# Altium schematic sheet down_converter_IF1.SchDoc: DOWN IF1
size A3; DocumentNumber: 18; Revision: 0; SheetNumber: 18; SheetTotal: 19
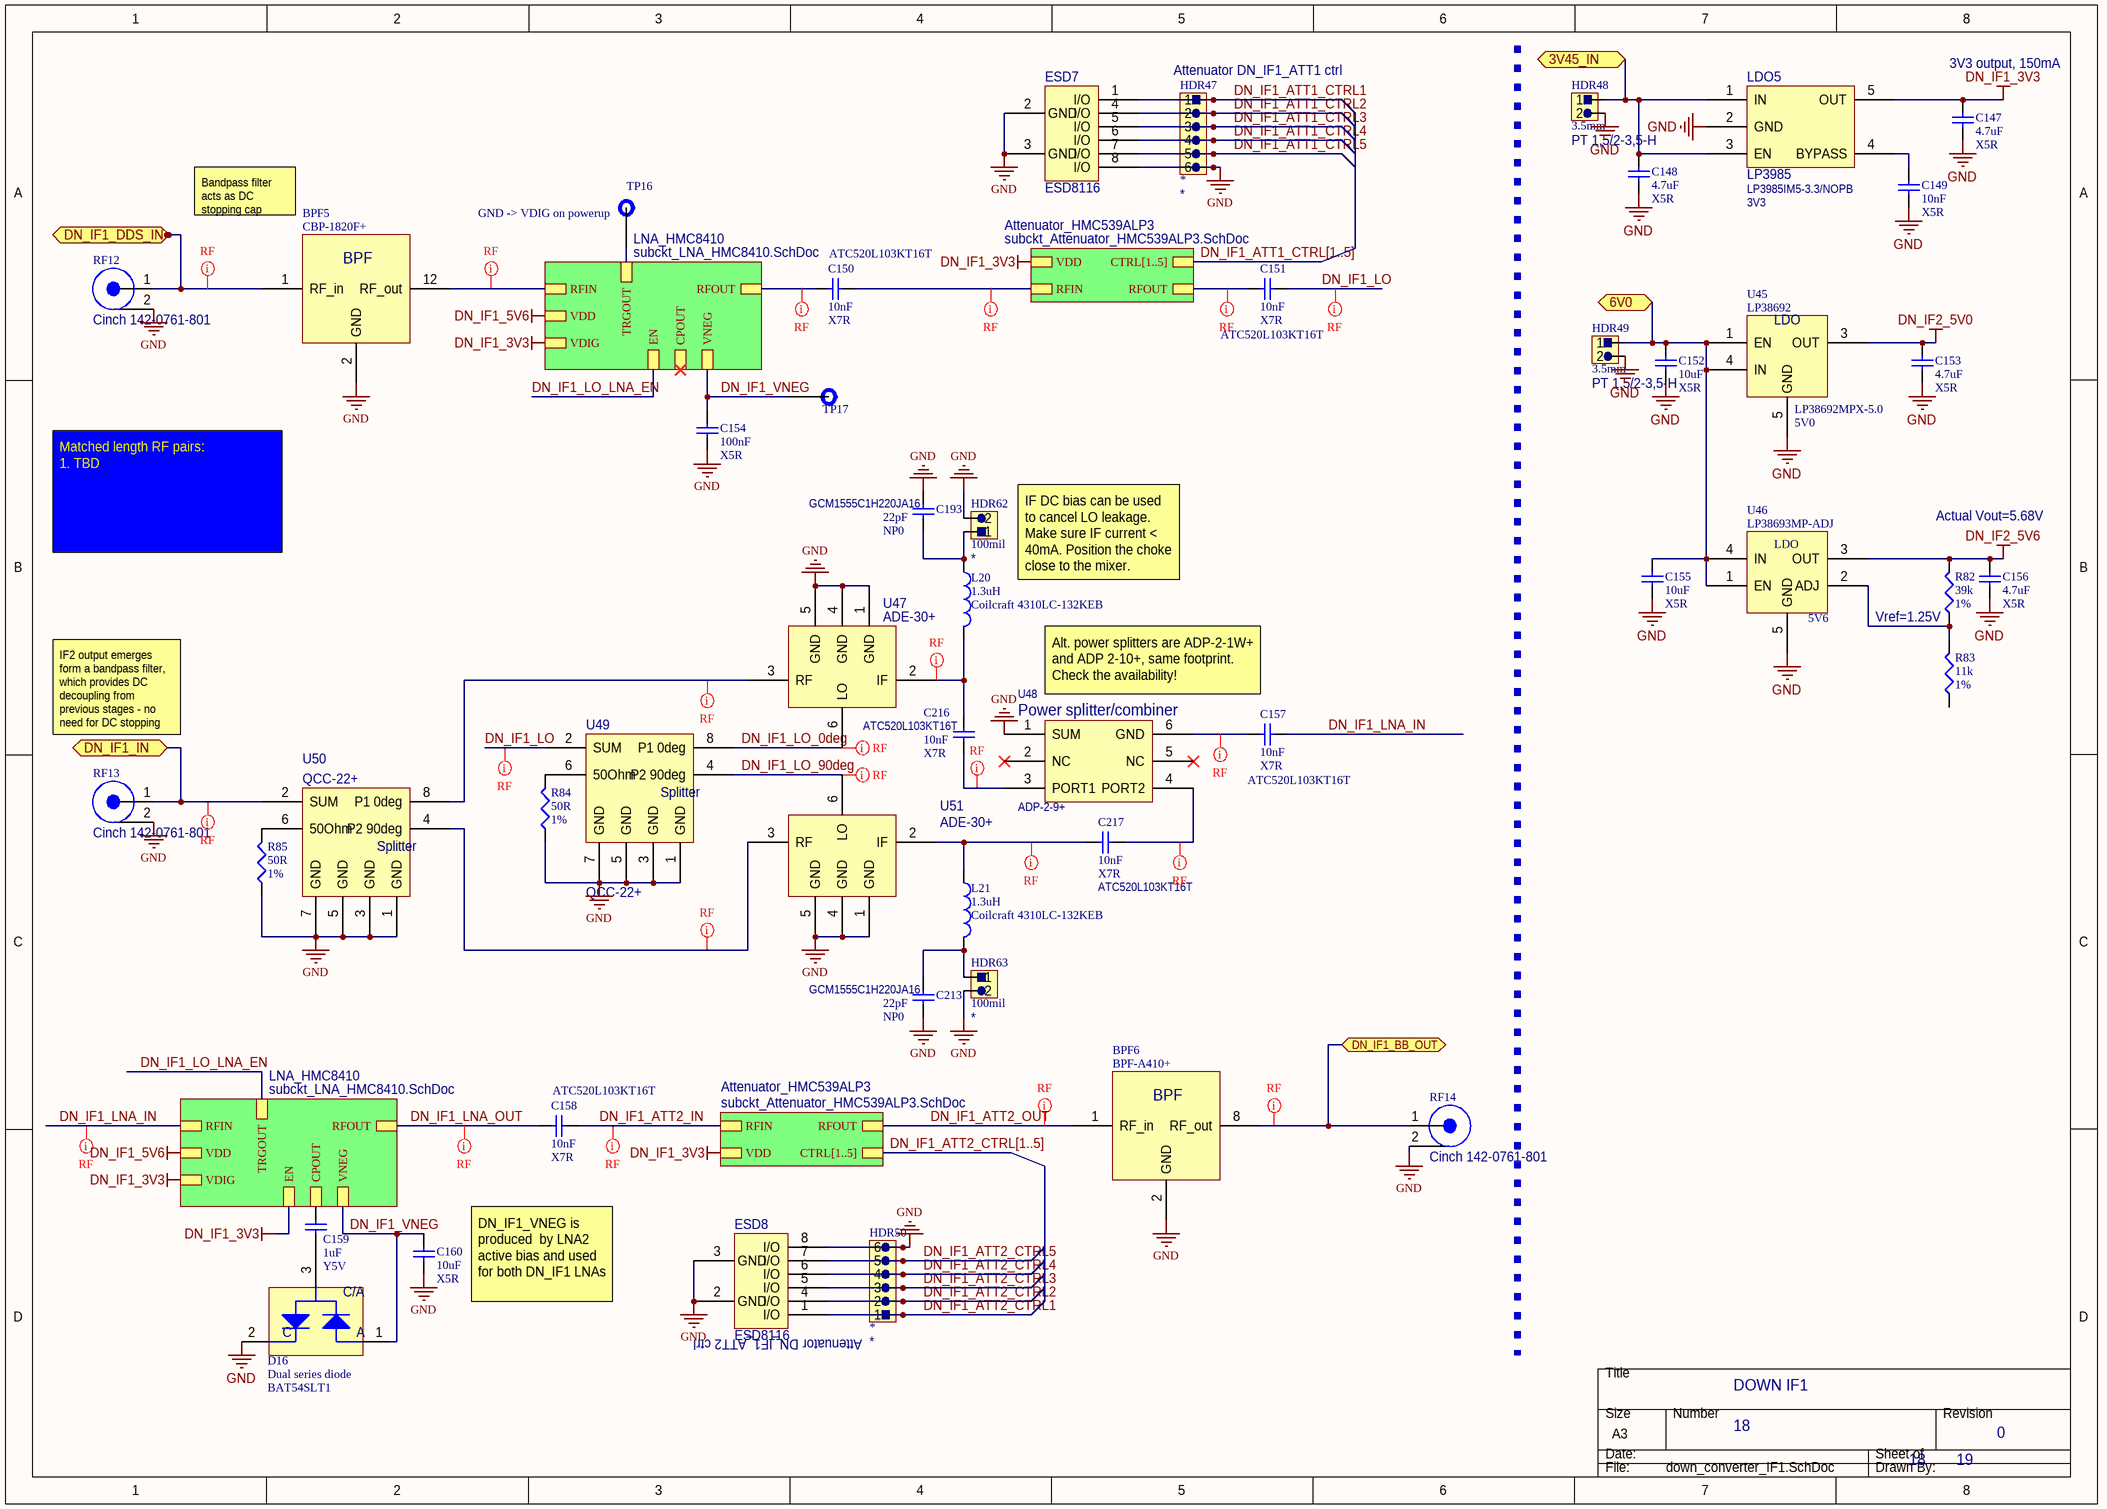
[diagram p0: down_converter_IF1.SchDoc]

## Parts
BPF5  CBP-1820F+
BPF6  BPF-A410+
C147  value 4.7uF  Dielectric: X5R  [CAP0603]  (hidden comment: Capacitor)
C148  value 4.7uF  Dielectric: X5R  [CAP0603]  (hidden comment: Capacitor)
C149  value 10nF  Dielectric: X5R  [CAP0603]  (hidden comment: Capacitor)
C150  ATC520L103KT16T  value 10nF  Dielectric: X7R  [TBD]
C151  ATC520L103KT16T  value 10nF  Dielectric: X7R  [TBD]
C152  value 10uF  Dielectric: X5R  [CAP0603]  (hidden comment: Capacitor)
C153  value 4.7uF  Dielectric: X5R  [TBD]  (hidden comment: Capacitor)
C154  value 100nF  Dielectric: X5R  [CAP0603]  (hidden comment: Capacitor)
C155  value 10uF  Dielectric: X5R  [CAP0603]  (hidden comment: Capacitor)
C156  value 4.7uF  Dielectric: X5R  [CAP0603]  (hidden comment: Capacitor)
C157  ATC520L103KT16T  value 10nF  Dielectric: X7R  [TBD]
C158  ATC520L103KT16T  value 10nF  Dielectric: X7R  [TBD]
C159  value 1uF  Dielectric: Y5V  [CAP0603]  (hidden comment: Capacitor)
C160  value 10uF  Dielectric: X5R  [CAP0603]  (hidden comment: Capacitor)
C193  value 22pF  Dielectric: NP0  Model: GCM1555C1H220JA16  [CAP0402]  (hidden comment: Capacitor)
C213  value 22pF  Dielectric: NP0  Model: GCM1555C1H220JA16  [CAP0402]  (hidden comment: Capacitor)
C216  value 10nF  Dielectric: X7R  [TBD]  (hidden comment: ATC520L103KT16T)
C217  value 10nF  Dielectric: X7R  [TBD]  (hidden comment: ATC520L103KT16T)
D16  Dual series diode  Model: BAT54SLT1  [SOT23-3]
ESD7  ESD8116
ESD8  ESD8116
HDR47  Header 6 pins  [TBD]  (value not drawn)
HDR48  Pitch: 3.5mm  Model: PT 1,5/2-3,5-H  [2X 3.5mm TH screw terminal - interlock]  (hidden comment: Header 2 pins)
HDR49  Pitch: 3.5mm  Model: PT 1,5/2-3,5-H  [2X 3.5mm TH screw terminal - interlock]  (hidden comment: Header 2 pins)
HDR50  Header 6 pins  [TBD]  (value not drawn)
HDR62  Pitch: 100mil  [2XHeader 100mil]  (hidden comment: Header 2 pins)
HDR63  Pitch: 100mil  [2XHeader 100mil]  (hidden comment: Header 2 pins)
L20  value 1.3uH  Model: Coilcraft 4310LC-132KEB  [TBD]  (hidden comment: Inductor)
L21  value 1.3uH  Model: Coilcraft 4310LC-132KEB  [TBD]  (hidden comment: Inductor)
LDO5  LP3985  Model: LP3985IM5-3.3/NOPB  Voltage: 3V3
R82  value 39k  Type: 1%  [RES0603]  (hidden comment: Resistor)
R83  value 11k  Type: 1%  [RES0603]  (hidden comment: Resistor)
R84  value 50R  Type: 1%  [RES0603]  (hidden comment: Resistor)
R85  value 50R  Type: 1%  [RES0603]  (hidden comment: Resistor)
RF12  Model: Cinch 142-0761-801  [TBD]  (hidden comment: RF connector w/ 2 pins)
RF13  Model: Cinch 142-0761-801  [TBD]  (hidden comment: RF connector w/ 2 pins)
RF14  Model: Cinch 142-0761-801  [TBD]  (hidden comment: RF connector w/ 2 pins)
TP16  GND -> VDIG on powerup  [1XHeader 100mil]  (no BOM)
TP17  Test point  [1XHeader 100mil]  (value not drawn)  (no BOM)
U45  LP38692  Model: LP38692MPX-5.0  Voltage: 5V0  [TBD]
U46  LDO  Model: LP38693MP-ADJ  Voltage: 5V6  [Model Name]
U47  ADE-30+
U48  ADP-2-9+  [Minicircuits_CD636]
U49  QCC-22+  [Minicircuits_GF981]
U50  QCC-22+  [Minicircuits_GF981]
U51  ADE-30+

## Sub-sheets
Attenuator_HMC539ALP3 = subckt_Attenuator_HMC539ALP3.SchDoc: VDD, RFOUT, RFIN, CTRL[1..5]
Attenuator_HMC539ALP3 = subckt_Attenuator_HMC539ALP3.SchDoc: VDD, RFOUT, RFIN, CTRL[1..5]
LNA_HMC8410 = subckt_LNA_HMC8410.SchDoc: RFOUT, RFIN, VDD, EN, VDIG, CPOUT, VNEG, TRGOUT
LNA_HMC8410 = subckt_LNA_HMC8410.SchDoc: RFOUT, RFIN, VDD, EN, VDIG, CPOUT, VNEG, TRGOUT

## Ports
3V45_IN, 6V0, DN_IF1_BB_OUT, DN_IF1_DDS_IN, DN_IF1_IN

## Nets
DN_IF1_3V3: C147.2 LDO5.5(OUT) ; sheet LNA_HMC8410/EN, sheet LNA_HMC8410/VDIG, sheet LNA_HMC8410/VDIG, sheet Attenuator_HMC539ALP3/VDD, sheet Attenuator_HMC539ALP3/VDD
DN_IF1_5V6: sheet LNA_HMC8410/VDD, sheet LNA_HMC8410/VDD
DN_IF2_5V0: C153.2 U45.3(OUT)
DN_IF2_5V6: C156.2 R82.2 U46.3(OUT)
GND: BPF5.2(GND) BPF5.3 BPF5.4 BPF5.5 BPF5.6 BPF5.7 BPF5.8 BPF5.9 BPF5.10 BPF5.11 BPF5.13 BPF5.14 BPF5.15 BPF5.16 BPF5.17 BPF6.2(GND) BPF6.3 BPF6.4 BPF6.5 BPF6.6 BPF6.7 BPF6.9 BPF6.10 BPF6.11 BPF6.12 BPF6.13 BPF6.14 C147.1 C148.1 C149.1 C152.1 C153.1 C154.1 C155.1 C156.1 C160.1 C193.1 C213.2 D16.2(C) ESD7.2(GND) ESD7.3(GND) ESD7.8(I/O) ESD8.2(GND) ESD8.3(GND) ESD8.8(I/O) HDR47.6 HDR48.2 HDR49.2 HDR50.6 HDR62.2 HDR63.2 LDO5.2(GND) R84.1 R85.1 RF12.2 RF13.2 RF14.2 U45.5(GND) U46.5(GND) U47.1(GND) U47.4(GND) U47.5(GND) U48.1(SUM) U49.1(GND) U49.3(GND) U49.5(GND) U49.7(GND) U50.1(GND) U50.3(GND) U50.5(GND) U50.7(GND) U51.1(GND) U51.4(GND) U51.5(GND)
3V45_IN: C148.2 HDR48.1 LDO5.1(IN) LDO5.3(EN) ; port 3V45_IN
6V0: C152.2 C155.2 HDR49.1 U45.1(EN) U45.4(IN) U46.1(EN) U46.4(IN) ; port 6V0
DN_IF1_ATT1_CTRL1: ESD7.1(I/O) HDR47.1
DN_IF1_ATT1_CTRL2: ESD7.4(I/O) HDR47.2
DN_IF1_ATT1_CTRL3: ESD7.5(I/O) HDR47.3
DN_IF1_ATT1_CTRL4: ESD7.6(I/O) HDR47.4
DN_IF1_ATT1_CTRL5: ESD7.7(I/O) HDR47.5
DN_IF1_ATT2_CTRL1: ESD8.1(I/O) HDR50.1
DN_IF1_ATT2_CTRL2: ESD8.4(I/O) HDR50.2
DN_IF1_ATT2_CTRL3: ESD8.5(I/O) HDR50.3
DN_IF1_ATT2_CTRL4: ESD8.6(I/O) HDR50.4
DN_IF1_ATT2_CTRL5: ESD8.7(I/O) HDR50.5
DN_IF1_ATT2_IN: C158.2 ; sheet Attenuator_HMC539ALP3/RFIN
DN_IF1_ATT2_OUT: BPF6.1(RF_in) ; sheet Attenuator_HMC539ALP3/RFOUT
DN_IF1_BB_OUT: BPF6.8(RF_out) RF14.1 ; port DN_IF1_BB_OUT
DN_IF1_DDS_IN: BPF5.1(RF_in) RF12.1 ; port DN_IF1_DDS_IN
DN_IF1_IN: RF13.1 U50.2(SUM) ; port DN_IF1_IN
DN_IF1_LNA_IN: C157.2 ; sheet LNA_HMC8410/RFIN
DN_IF1_LNA_OUT: C158.1 ; sheet LNA_HMC8410/RFOUT
DN_IF1_LO: C151.2 U49.2(SUM)
DN_IF1_LO_0deg: U47.6(LO) U49.8(P1_0deg)
DN_IF1_LO_90deg: U49.4(P2_90deg) U51.6(LO)
DN_IF1_LO_LNA_EN: sheet LNA_HMC8410/TRGOUT, sheet LNA_HMC8410/EN
DN_IF1_VNEG: C154.2 C160.2 D16.1(A) TP17.1 ; sheet LNA_HMC8410/VNEG, sheet LNA_HMC8410/VNEG
NetBPF5_12: BPF5.12(RF_out) ; sheet LNA_HMC8410/RFIN
NetC149_2: C149.2 LDO5.4(BYPASS)
NetC150_1: C150.1 ; sheet LNA_HMC8410/RFOUT
NetC150_2: C150.2 ; sheet Attenuator_HMC539ALP3/RFIN
NetC151_1: C151.1 ; sheet Attenuator_HMC539ALP3/RFOUT
NetC157_1: C157.1 U48.6(GND)
NetC159_1: C159.1 D16.3(C/A)
NetC159_2: C159.2 ; sheet LNA_HMC8410/CPOUT
NetC193_2: C193.2 HDR62.1 L20.1
NetC213_1: C213.1 HDR63.1 L21.1
NetC216_1: C216.1 U48.3(PORT1)
NetC216_2: C216.2 L20.2 U47.2(IF)
NetC217_1: C217.1 U48.4(PORT2)
NetC217_2: C217.2 L21.2 U51.2(IF)
NetR82_1: R82.1 R83.2 U46.2(ADJ)
NetR84_2: R84.2 U49.6(50Ohm)
NetR85_2: R85.2 U50.6(50Ohm)
NetTP16_1: TP16.1 ; sheet LNA_HMC8410/TRGOUT
NetU47_3: U47.3(RF) U50.8(P1_0deg)
NetU50_4: U50.4(P2_90deg) U51.3(RF)

Not connected (* = marked no-connect by the designer): R83 1; U45 2(NC); U48 2(NC)* 5(NC)*

## Buses and harness runs
bus DN_IF1_ATT1_CTRL[1..5] = sheet Attenuator_HMC539ALP3/CTRL[1..5]
bus DN_IF1_ATT2_CTRL[1..5] = sheet Attenuator_HMC539ALP3/CTRL[1..5]

## Layout directives
net class RF: DN_IF1_ATT2_IN, DN_IF1_ATT2_OUT, DN_IF1_BB_OUT, DN_IF1_DDS_IN, DN_IF1_IN, DN_IF1_LNA_IN, DN_IF1_LNA_OUT, DN_IF1_LO, DN_IF1_LO_0deg, DN_IF1_LO_90deg, NetBPF5_12, NetC150_1, NetC150_2, NetC151_1, NetC157_1, NetC216_1, NetC216_2, NetC217_1, NetC217_2, NetU47_3, NetU50_4

## Notes on the sheet
- (near HDR47) Attenuator DN_IF1_ATT1 ctrl
- (near C147) 3V3 output, 150mA
- Bandpass filter acts as DC stopping cap
- Matched length RF pairs:
  1. TBD
- IF DC bias can be used to cancel LO leakage. Make sure IF current < 40mA. Position the choke close to the mixer.
- Actual Vout=5.68V
- (near R82) Vref=1.25V
- Alt. power splitters are ADP-2-1W+ and ADP 2-10+, same footprint. Check the availability!
- IF2 output emerges form a bandpass filter, which provides DC decoupling from previous stages - no need for DC stopping cap at DN_IF1_IN
- (near C160) DN_IF1_VNEG is produced  by LNA2 active bias and used for both DN_IF1 LNAs
- (near HDR50) Attenuator DN_IF1_ATT2 ctrl
- (in symbol LP38692) LDO
- (in symbol minicircuits_ADP-2-9+) Power splitter/combiner
- (in symbol minicircuits_BPF-A410+) BPF
- (in symbol minicircuits_CBP-1820F+) BPF
- (in symbol minicircuits_QCC-22+) Splitter

## Library data of the parts
BPF5 = minicircuits_CBP-1820F+: Mini-Circuits band pass filter 1680-1960 MHz
BPF6 = minicircuits_BPF-A410+: Mini-Circuits band pass filter 365-465 MHz
C150 C151 C157 C158 C216 C217 = Capacitor
  C216 C217: Model: ATC520L103KT16T
D16 = D dual series diode
ESD7 ESD8 = ON_ESD8116: On Semi 6ch 3.3V ESD diodes
HDR47 HDR50 = Header6: Pitch: *; Model: *
HDR48 HDR49 HDR62 HDR63 = Header2
  HDR62 HDR63: Model: *
LDO5 = LP3985: LDO 150mA
RF12-RF14 = RF_connector: RF connector w/  pin and barrel
TP16 = Test point
U45 = LP38692: LDO LP38692
U46 = LDO_Adj: Adjustable LDO
U47 U51 = minicircuits_ADE-30+: Minicircuits mixer ADE-30+, 200MHz-3000MHz
U48 = minicircuits_ADP-2-9+: Minicircuits power splitter ADP-2-9+
U49 U50 = minicircuits_QCC-22+: Mini-Circuits_ power splitter/combiner QCC-22+, 1.5-2.5GHz